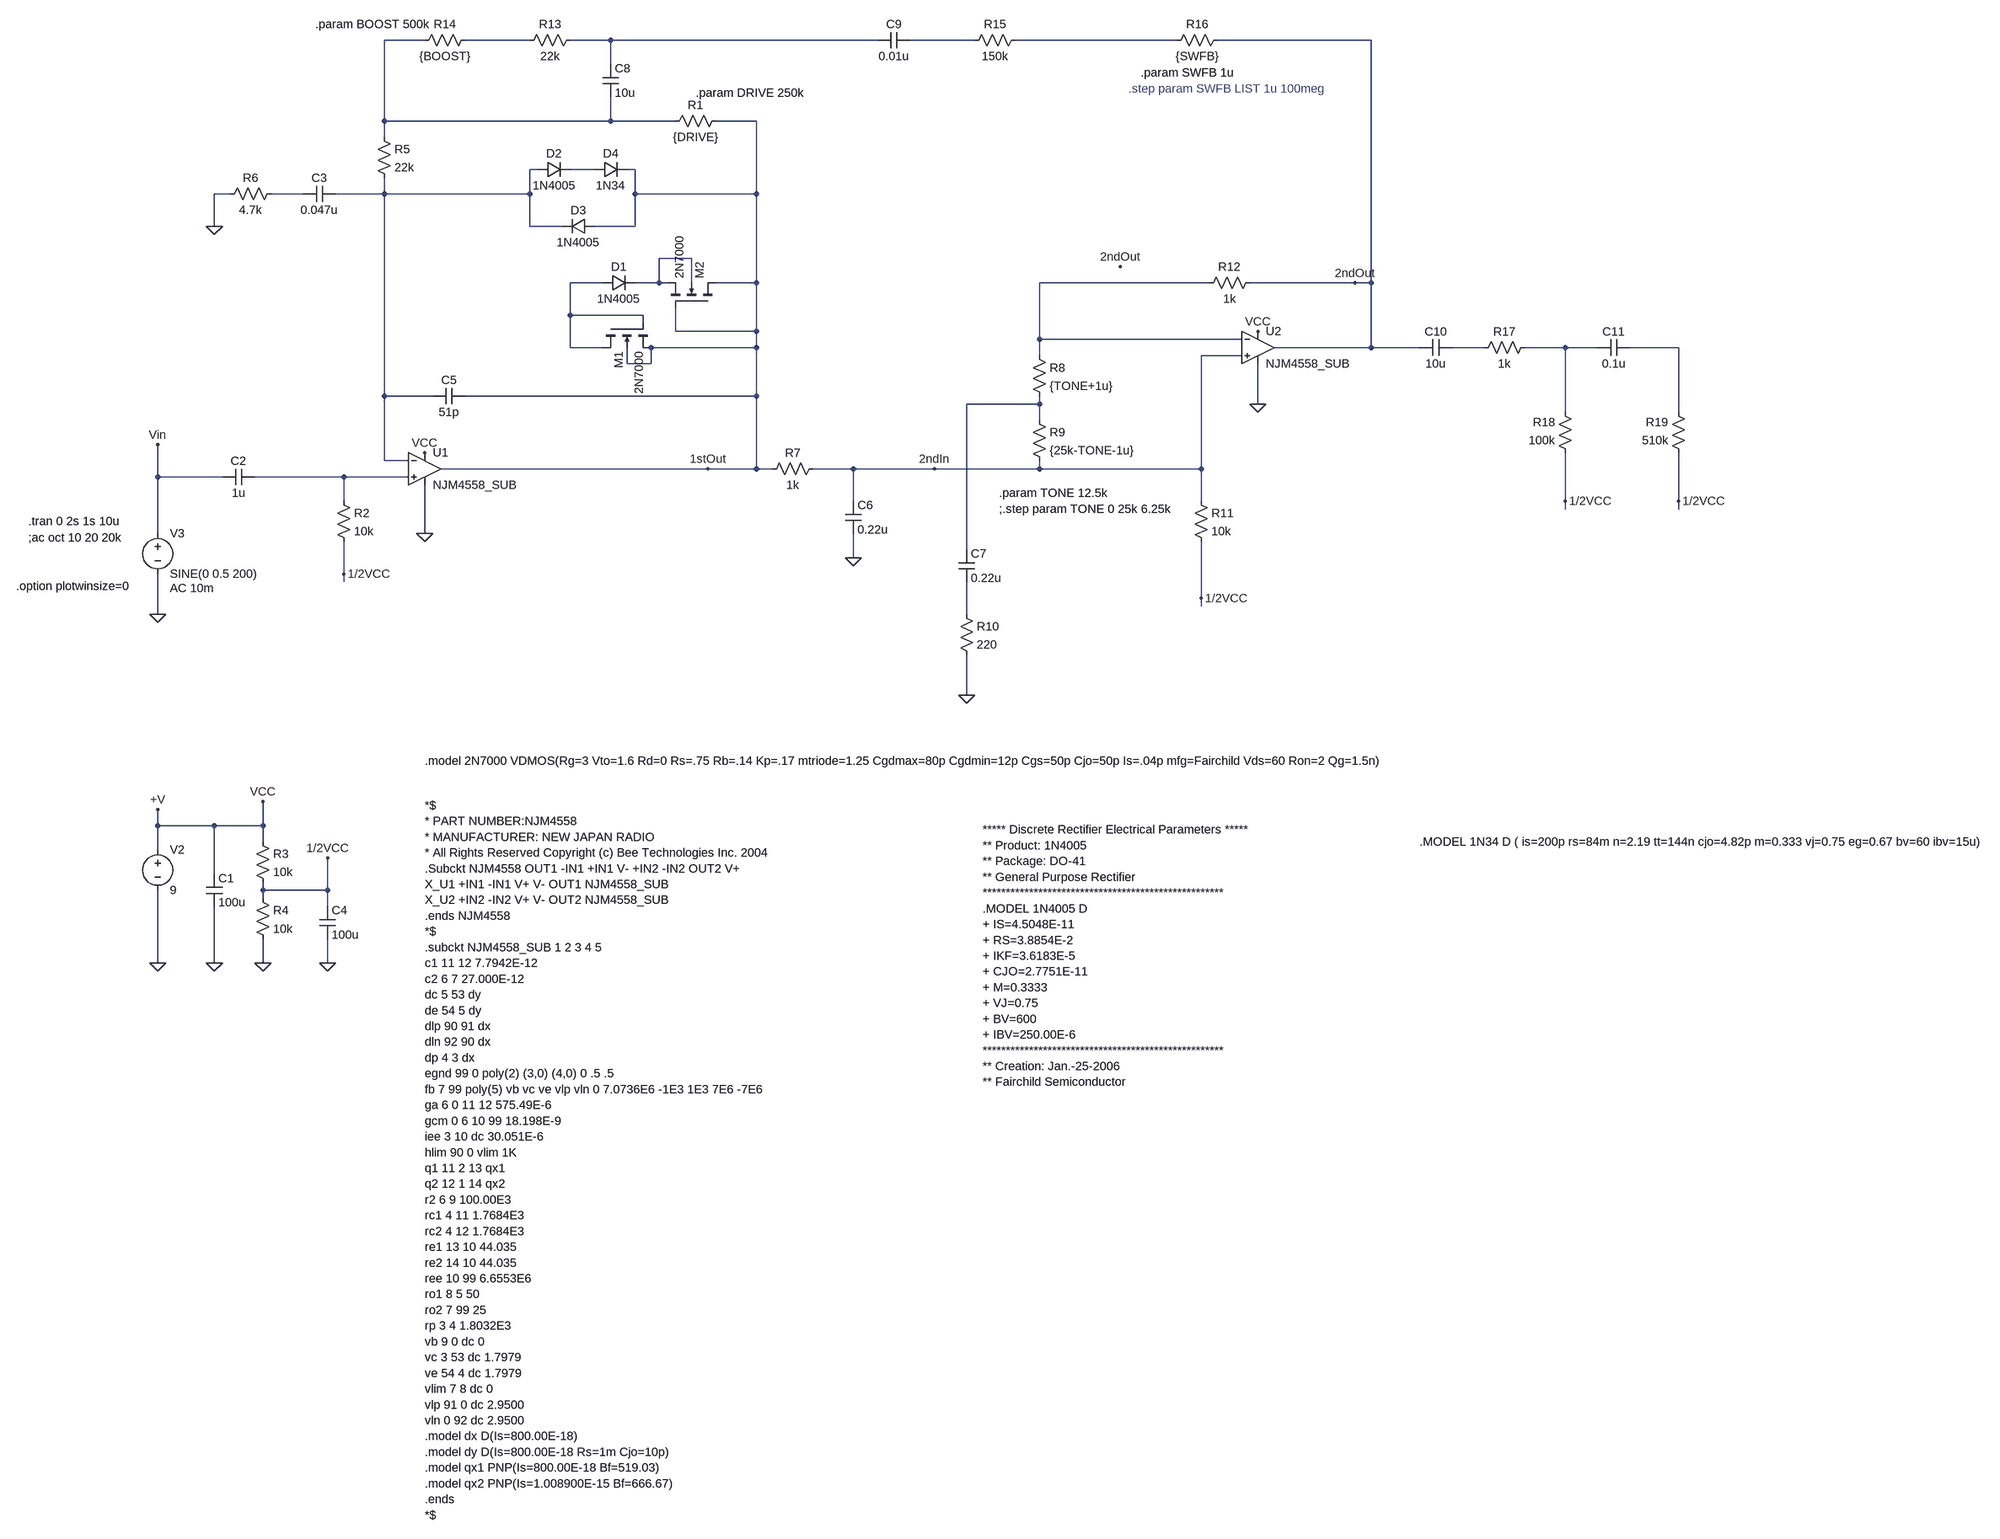
[diagram p0: schematic fulldrive2.asc]
fulldrive2.asc, the LTspice schematic file:
Version 4
SHEET 1 3496 2116
WIRE 240 -704 160 -704
WIRE 448 -704 320 -704
WIRE 608 -704 528 -704
WIRE 1136 -704 608 -704
WIRE 1328 -704 1200 -704
WIRE 1728 -704 1408 -704
WIRE 2112 -704 1808 -704
WIRE 608 -656 608 -704
WIRE 160 -544 160 -704
WIRE 608 -544 608 -592
WIRE 608 -544 160 -544
WIRE 736 -544 608 -544
WIRE 896 -544 816 -544
WIRE 160 -512 160 -544
WIRE 464 -448 448 -448
WIRE 576 -448 528 -448
WIRE 656 -448 640 -448
WIRE -144 -400 -176 -400
WIRE 0 -400 -64 -400
WIRE 160 -400 160 -432
WIRE 160 -400 64 -400
WIRE 448 -400 448 -448
WIRE 448 -400 160 -400
WIRE 656 -400 656 -448
WIRE 896 -400 896 -544
WIRE 896 -400 656 -400
WIRE -176 -336 -176 -400
WIRE 448 -336 448 -400
WIRE 512 -336 448 -336
WIRE 656 -336 656 -400
WIRE 656 -336 576 -336
WIRE 768 -272 704 -272
WIRE 592 -224 528 -224
WIRE 704 -224 704 -272
WIRE 704 -224 656 -224
WIRE 720 -224 704 -224
WIRE 768 -224 768 -272
WIRE 896 -224 896 -400
WIRE 896 -224 816 -224
WIRE 1792 -224 1456 -224
WIRE 2080 -224 1872 -224
WIRE 2112 -224 2112 -704
WIRE 2112 -224 2080 -224
WIRE 528 -160 528 -224
WIRE 672 -160 528 -160
WIRE 672 -144 672 -160
WIRE 736 -128 736 -176
WIRE 896 -128 896 -224
WIRE 896 -128 736 -128
WIRE 1456 -112 1456 -224
WIRE 1856 -112 1456 -112
WIRE 528 -96 528 -160
WIRE 592 -96 528 -96
WIRE 896 -96 896 -128
WIRE 896 -96 688 -96
WIRE 2112 -96 2112 -224
WIRE 2112 -96 1920 -96
WIRE 2208 -96 2112 -96
WIRE 2336 -96 2272 -96
WIRE 2496 -96 2416 -96
WIRE 2560 -96 2496 -96
WIRE 2720 -96 2624 -96
WIRE 1456 -80 1456 -112
WIRE 1856 -80 1776 -80
WIRE 640 -64 640 -96
WIRE 688 -64 688 -96
WIRE 688 -64 640 -64
WIRE 160 0 160 -400
WIRE 256 0 160 0
WIRE 896 0 896 -96
WIRE 896 0 320 0
WIRE 1456 16 1456 0
WIRE 1456 16 1312 16
WIRE 1888 16 1888 -64
WIRE 2496 32 2496 -96
WIRE 2720 32 2720 -96
WIRE 1456 48 1456 16
WIRE 160 128 160 0
WIRE 208 128 160 128
WIRE 800 144 272 144
WIRE 896 144 896 0
WIRE 896 144 800 144
WIRE 928 144 896 144
WIRE 1088 144 1008 144
WIRE 1248 144 1088 144
WIRE 1456 144 1456 128
WIRE 1456 144 1248 144
WIRE 1776 144 1776 -80
WIRE 1776 144 1456 144
WIRE -288 160 -288 96
WIRE -160 160 -288 160
WIRE 80 160 -96 160
WIRE 208 160 80 160
WIRE 80 208 80 160
WIRE 1088 208 1088 144
WIRE 1776 208 1776 144
WIRE 2496 208 2496 112
WIRE 2720 208 2720 112
WIRE 2496 224 2496 208
WIRE 2720 224 2720 208
WIRE -288 272 -288 160
WIRE 240 272 240 176
WIRE 1312 304 1312 16
WIRE 1088 320 1088 272
WIRE 80 352 80 288
WIRE 80 368 80 352
WIRE 1776 400 1776 288
WIRE 1776 416 1776 400
WIRE -288 432 -288 352
WIRE 1312 432 1312 368
WIRE 1312 592 1312 512
WIRE -288 880 -288 848
WIRE -176 880 -288 880
WIRE -80 880 -80 832
WIRE -80 880 -176 880
WIRE -80 912 -80 880
WIRE -288 928 -288 880
WIRE -176 976 -176 880
WIRE -80 1008 -80 992
WIRE 48 1008 48 944
WIRE 48 1008 -80 1008
WIRE -80 1024 -80 1008
WIRE 48 1040 48 1008
WIRE -288 1152 -288 1008
WIRE -176 1152 -176 1040
WIRE -80 1152 -80 1104
WIRE 48 1152 48 1104
FLAG -288 432 0
FLAG -288 1152 0
FLAG -288 848 +V
FLAG 240 112 VCC
FLAG -176 1152 0
FLAG -80 1152 0
FLAG 48 1152 0
FLAG 48 944 1/2VCC
FLAG -80 832 VCC
FLAG 240 272 0
FLAG -288 96 Vin
FLAG 80 352 1/2VCC
FLAG -176 -336 0
FLAG 1088 320 0
FLAG 800 144 1stOut
FLAG 1312 592 0
FLAG 1776 400 1/2VCC
FLAG 2080 -224 2ndOut
FLAG 1616 -256 2ndOut
FLAG 1888 -128 VCC
FLAG 1888 16 0
FLAG 1248 144 2ndIn
FLAG 2496 208 1/2VCC
FLAG 2720 208 1/2VCC
SYMBOL Opamps\\opamp2 240 80 R0
SYMATTR InstName U1
SYMATTR Value NJM4558_SUB
SYMBOL voltage -288 912 R0
WINDOW 123 0 0 Left 2
WINDOW 39 0 0 Left 2
SYMATTR InstName V2
SYMATTR Value 9
SYMBOL voltage -288 256 R0
WINDOW 123 24 124 Left 2
WINDOW 39 0 0 Left 2
SYMATTR Value2 AC 10m
SYMATTR InstName V3
SYMATTR Value SINE(0 0.5 200)
SYMBOL res 832 -560 R90
WINDOW 0 0 56 VBottom 2
WINDOW 3 32 56 VTop 2
SYMATTR InstName R1
SYMATTR Value {DRIVE}
SYMBOL cap -192 976 R0
SYMATTR InstName C1
SYMATTR Value 100u
SYMBOL res -96 896 R0
SYMATTR InstName R3
SYMATTR Value 10k
SYMBOL res -96 1008 R0
SYMATTR InstName R4
SYMATTR Value 10k
SYMBOL cap -96 144 R90
WINDOW 0 0 32 VBottom 2
WINDOW 3 32 32 VTop 2
SYMATTR InstName C2
SYMATTR Value 1u
SYMBOL res 64 192 R0
SYMATTR InstName R2
SYMATTR Value 10k
SYMBOL res 144 -528 R0
SYMATTR InstName R5
SYMATTR Value 22k
SYMBOL res -48 -416 R90
WINDOW 0 0 56 VBottom 2
WINDOW 3 32 56 VTop 2
SYMATTR InstName R6
SYMATTR Value 4.7k
SYMBOL cap 64 -416 R90
WINDOW 0 0 32 VBottom 2
WINDOW 3 32 32 VTop 2
SYMATTR InstName C3
SYMATTR Value 0.047u
SYMBOL cap 32 1040 R0
SYMATTR InstName C4
SYMATTR Value 100u
SYMBOL cap 320 -16 R90
WINDOW 0 0 32 VBottom 2
WINDOW 3 32 32 VTop 2
SYMATTR InstName C5
SYMATTR Value 51p
SYMBOL res 1024 128 R90
WINDOW 0 0 56 VBottom 2
WINDOW 3 32 56 VTop 2
SYMATTR InstName R7
SYMATTR Value 1k
SYMBOL cap 1072 208 R0
SYMATTR InstName C6
SYMATTR Value 0.22u
SYMBOL Opamps\\opamp2 1888 -160 R0
SYMATTR InstName U2
SYMATTR Value NJM4558_SUB
SYMBOL res 1440 -96 R0
SYMATTR InstName R8
SYMATTR Value {TONE+1u}
SYMBOL res 1440 32 R0
SYMATTR InstName R9
SYMATTR Value {25k-TONE-1u}
SYMBOL cap 1296 304 R0
SYMATTR InstName C7
SYMATTR Value 0.22u
SYMBOL res 1296 416 R0
SYMATTR InstName R10
SYMATTR Value 220
SYMBOL res 1760 192 R0
SYMATTR InstName R11
SYMATTR Value 10k
SYMBOL res 1888 -240 R90
WINDOW 0 0 56 VBottom 2
WINDOW 3 32 56 VTop 2
SYMATTR InstName R12
SYMATTR Value 1k
SYMBOL res 544 -720 R90
WINDOW 0 0 56 VBottom 2
WINDOW 3 32 56 VTop 2
SYMATTR InstName R13
SYMATTR Value 22k
SYMBOL cap 592 -656 R0
SYMATTR InstName C8
SYMATTR Value 10u
SYMBOL res 336 -720 R90
WINDOW 0 0 56 VBottom 2
WINDOW 3 32 56 VTop 2
SYMATTR InstName R14
SYMATTR Value {BOOST}
SYMBOL res 1424 -720 R90
WINDOW 0 0 56 VBottom 2
WINDOW 3 32 56 VTop 2
SYMATTR InstName R15
SYMATTR Value 150k
SYMBOL cap 1200 -720 R90
WINDOW 0 0 32 VBottom 2
WINDOW 3 32 32 VTop 2
SYMATTR InstName C9
SYMATTR Value 0.01u
SYMBOL res 1824 -720 R90
WINDOW 0 0 56 VBottom 2
WINDOW 3 32 56 VTop 2
SYMATTR InstName R16
SYMATTR Value {SWFB}
SYMBOL diode 592 -240 M90
WINDOW 0 0 32 VBottom 2
WINDOW 3 32 32 VTop 2
SYMATTR InstName D1
SYMATTR Value 1N4005
SYMBOL nmos4 592 -144 M90
SYMATTR InstName M1
SYMATTR Value 2N7000
SYMBOL nmos4 816 -176 M270
SYMATTR InstName M2
SYMATTR Value 2N7000
SYMBOL diode 464 -464 M90
WINDOW 0 0 32 VBottom 2
WINDOW 3 32 32 VTop 2
SYMATTR InstName D2
SYMATTR Value 1N4005
SYMBOL diode 576 -352 R90
WINDOW 0 0 32 VBottom 2
WINDOW 3 32 32 VTop 2
SYMATTR InstName D3
SYMATTR Value 1N4005
SYMBOL diode 576 -464 M90
WINDOW 0 0 32 VBottom 2
WINDOW 3 32 32 VTop 2
SYMATTR InstName D4
SYMATTR Value 1N34
SYMBOL cap 2272 -112 R90
WINDOW 0 0 32 VBottom 2
WINDOW 3 32 32 VTop 2
SYMATTR InstName C10
SYMATTR Value 10u
SYMBOL res 2432 -112 R90
WINDOW 0 0 56 VBottom 2
WINDOW 3 32 56 VTop 2
SYMATTR InstName R17
SYMATTR Value 1k
SYMBOL res 2512 128 R180
WINDOW 0 36 76 Left 2
WINDOW 3 36 40 Left 2
SYMATTR InstName R18
SYMATTR Value 100k
SYMBOL res 2736 128 R180
WINDOW 0 36 76 Left 2
WINDOW 3 36 40 Left 2
SYMATTR InstName R19
SYMATTR Value 510k
SYMBOL cap 2624 -112 R90
WINDOW 0 0 32 VBottom 2
WINDOW 3 32 32 VTop 2
SYMATTR InstName C11
SYMATTR Value 0.1u
TEXT 240 840 Left 2 !*$\n* PART NUMBER:NJM4558\n* MANUFACTURER: NEW JAPAN RADIO\n* All Rights Reserved Copyright (c) Bee Technologies Inc. 2004\n.Subckt NJM4558 OUT1 -IN1 +IN1 V- +IN2 -IN2 OUT2 V+\nX_U1 +IN1 -IN1 V+ V- OUT1 NJM4558_SUB\nX_U2 +IN2 -IN2 V+ V- OUT2 NJM4558_SUB\n.ends NJM4558\n*$\n.subckt NJM4558_SUB 1 2 3 4 5\nc1 11 12 7.7942E-12\nc2 6 7 27.000E-12\ndc 5 53 dy\nde 54 5 dy\ndlp 90 91 dx\ndln 92 90 dx\ndp 4 3 dx\negnd 99 0 poly(2) (3,0) (4,0) 0 .5 .5\nfb 7 99 poly(5) vb vc ve vlp vln 0 7.0736E6 -1E3 1E3 7E6 -7E6\nga 6 0 11 12 575.49E-6\ngcm 0 6 10 99 18.198E-9\niee 3 10 dc 30.051E-6\nhlim 90 0 vlim 1K\nq1 11 2 13 qx1\nq2 12 1 14 qx2\nr2 6 9 100.00E3\nrc1 4 11 1.7684E3\nrc2 4 12 1.7684E3\nre1 13 10 44.035\nre2 14 10 44.035\nree 10 99 6.6553E6\nro1 8 5 50\nro2 7 99 25\nrp 3 4 1.8032E3\nvb 9 0 dc 0\nvc 3 53 dc 1.7979\nve 54 4 dc 1.7979\nvlim 7 8 dc 0\nvlp 91 0 dc 2.9500\nvln 0 92 dc 2.9500\n.model dx D(Is=800.00E-18)\n.model dy D(Is=800.00E-18 Rs=1m Cjo=10p)\n.model qx1 PNP(Is=800.00E-18 Bf=519.03)\n.model qx2 PNP(Is=1.008900E-15 Bf=666.67)\n.ends\n*$
TEXT -544 280 Left 2 !;ac oct 10 20 20k
TEXT -544 248 Left 2 !.tran 0 2s 1s 10u
TEXT 776 -600 Left 2 !.param DRIVE 250k
TEXT 1376 192 Left 2 !.param TONE 12.5k\n;.step param TONE 0 25k 6.25k
TEXT 24 -736 Left 2 !.param BOOST 500k
TEXT 1656 -640 Left 2 !.param SWFB 1u
TEXT 1632 -608 Left 2 ;.step param SWFB LIST 1u 100meg
TEXT 240 752 Left 2 !.model 2N7000 VDMOS(Rg=3 Vto=1.6 Rd=0 Rs=.75 Rb=.14 Kp=.17 mtriode=1.25 Cgdmax=80p Cgdmin=12p Cgs=50p Cjo=50p Is=.04p mfg=Fairchild Vds=60 Ron=2 Qg=1.5n)
TEXT 1344 888 Left 2 !***** Discrete Rectifier Electrical Parameters *****\n** Product: 1N4005\n** Package: DO-41\n** General Purpose Rectifier\n****************************************************\n.MODEL 1N4005 D\n+ IS=4.5048E-11\n+ RS=3.8854E-2\n+ IKF=3.6183E-5\n+ CJO=2.7751E-11\n+ M=0.3333\n+ VJ=0.75\n+ BV=600\n+ IBV=250.00E-6\n****************************************************\n** Creation: Jan.-25-2006\n** Fairchild Semiconductor
TEXT 2208 912 Left 2 !.MODEL 1N34 D ( is=200p rs=84m n=2.19 tt=144n cjo=4.82p m=0.333 vj=0.75 eg=0.67 bv=60 ibv=15u)
TEXT -568 376 Left 2 !.option plotwinsize=0

The netlist it stands for:
* fulldrive2.asc
XU1 N016 N006 VCC 0 1stOut NJM4558_SUB  ; pins In+ In- V+ V- OUT
V2 VCC 0 9
V3 Vin 0 SINE(0 0.5 200) AC 10m
R1 1stOut N001 {DRIVE}
C1 VCC 0 100u
R3 VCC 1/2VCC 10k
R4 1/2VCC 0 10k
C2 N016 Vin 1u
R2 N016 1/2VCC 10k
R5 N001 N006 22k
R6 N008 0 4.7k
C3 N006 N008 0.047u
C4 1/2VCC 0 100u
C5 1stOut N006 51p
R7 2ndIn 1stOut 1k
C6 2ndIn 0 0.22u
XU2 2ndIn N011 VCC 0 2ndOut NJM4558_SUB  ; pins In+ In- V+ V- OUT
R8 N011 N015 {TONE+1u}
R9 N015 2ndIn {25k-TONE-1u}
C7 N015 N017 0.22u
R10 N017 0 220
R11 2ndIn 1/2VCC 10k
R12 2ndOut N011 1k
R13 N003 N002 22k
C8 N003 N001 10u
R14 N002 N001 {BOOST}
R15 N005 N004 150k
C9 N004 N003 0.01u
R16 2ndOut N005 {SWFB}
D1 N010 N009 1N4005
M1 N010 N010 1stOut 1stOut 2N7000
M2 1stOut 1stOut N009 N009 2N7000
D2 N006 N007 1N4005
D3 1stOut N006 1N4005
D4 N007 1stOut 1N34
C10 N012 2ndOut 10u
R17 N013 N012 1k
R18 1/2VCC N013 100k
R19 1/2VCC N014 510k
C11 N014 N013 0.1u
.model D D
.lib standard.dio
.model NMOS NMOS
.model PMOS PMOS
.lib standard.mos
*$
* PART NUMBER:NJM4558
* MANUFACTURER: NEW JAPAN RADIO
* All Rights Reserved Copyright (c) Bee Technologies Inc. 2004
.Subckt NJM4558 OUT1 -IN1 +IN1 V- +IN2 -IN2 OUT2 V+
X_U1 +IN1 -IN1 V+ V- OUT1 NJM4558_SUB
X_U2 +IN2 -IN2 V+ V- OUT2 NJM4558_SUB
.ends NJM4558
*$
.subckt NJM4558_SUB 1 2 3 4 5
c1 11 12 7.7942E-12
c2 6 7 27.000E-12
dc 5 53 dy
de 54 5 dy
dlp 90 91 dx
dln 92 90 dx
dp 4 3 dx
egnd 99 0 poly(2) (3,0) (4,0) 0 .5 .5
fb 7 99 poly(5) vb vc ve vlp vln 0 7.0736E6 -1E3 1E3 7E6 -7E6
ga 6 0 11 12 575.49E-6
gcm 0 6 10 99 18.198E-9
iee 3 10 dc 30.051E-6
hlim 90 0 vlim 1K
q1 11 2 13 qx1
q2 12 1 14 qx2
r2 6 9 100.00E3
rc1 4 11 1.7684E3
rc2 4 12 1.7684E3
re1 13 10 44.035
re2 14 10 44.035
ree 10 99 6.6553E6
ro1 8 5 50
ro2 7 99 25
rp 3 4 1.8032E3
vb 9 0 dc 0
vc 3 53 dc 1.7979
ve 54 4 dc 1.7979
vlim 7 8 dc 0
vlp 91 0 dc 2.9500
vln 0 92 dc 2.9500
.model dx D(Is=800.00E-18)
.model dy D(Is=800.00E-18 Rs=1m Cjo=10p)
.model qx1 PNP(Is=800.00E-18 Bf=519.03)
.model qx2 PNP(Is=1.008900E-15 Bf=666.67)
.ends
*$
;ac oct 10 20 20k
.tran 0 2s 1s 10u
.param DRIVE 250k
.param TONE 12.5k
;.step param TONE 0 25k 6.25k
.param BOOST 500k
.param SWFB 1u
* .step param SWFB LIST 1u 100meg
.model 2N7000 VDMOS(Rg=3 Vto=1.6 Rd=0 Rs=.75 Rb=.14 Kp=.17 mtriode=1.25 Cgdmax=80p Cgdmin=12p Cgs=50p Cjo=50p Is=.04p mfg=Fairchild Vds=60 Ron=2 Qg=1.5n)
***** Discrete Rectifier Electrical Parameters *****
** Product: 1N4005
** Package: DO-41
** General Purpose Rectifier
****************************************************
.MODEL 1N4005 D
+ IS=4.5048E-11
+ RS=3.8854E-2
+ IKF=3.6183E-5
+ CJO=2.7751E-11
+ M=0.3333
+ VJ=0.75
+ BV=600
+ IBV=250.00E-6
****************************************************
** Creation: Jan.-25-2006
** Fairchild Semiconductor
.MODEL 1N34 D ( is=200p rs=84m n=2.19 tt=144n cjo=4.82p m=0.333 vj=0.75 eg=0.67 bv=60 ibv=15u)
.option plotwinsize=0
.backanno
.end